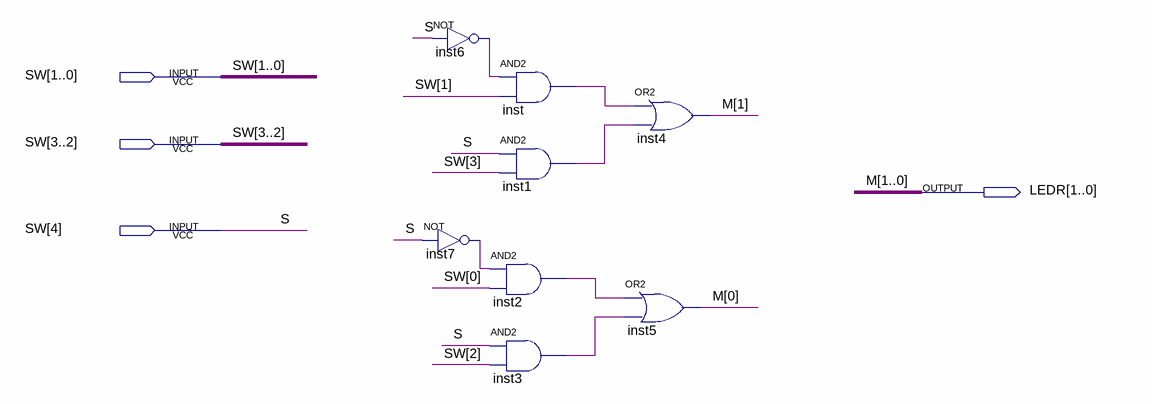
[diagram p0: schematic sheet]
// Quartus schematic top_level.bdf as structural Verilog: 8 symbols, 4 pins
module top_level (
  input  [4:0] SW,
  output [1:0] LEDR
);

  wire inst1_out, inst2_out, inst3_out, inst6_out, inst7_out, inst_out;

  not inst6 (inst6_out, SW[4]);
  not inst7 (inst7_out, SW[4]);
  and inst2 (inst2_out, inst7_out, SW[0]);
  and inst3 (inst3_out, SW[4], SW[2]);
  and inst (inst_out, inst6_out, SW[1]);
  and inst1 (inst1_out, SW[4], SW[3]);
  or inst4 (LEDR[1], inst_out, inst1_out);
  or inst5 (LEDR[0], inst2_out, inst3_out);

  // Other names for the same wires on the sheet: M[1:0] = LEDR; S = SW[4]
endmodule
